# Altium schematic sheet other.SchDoc
size A4
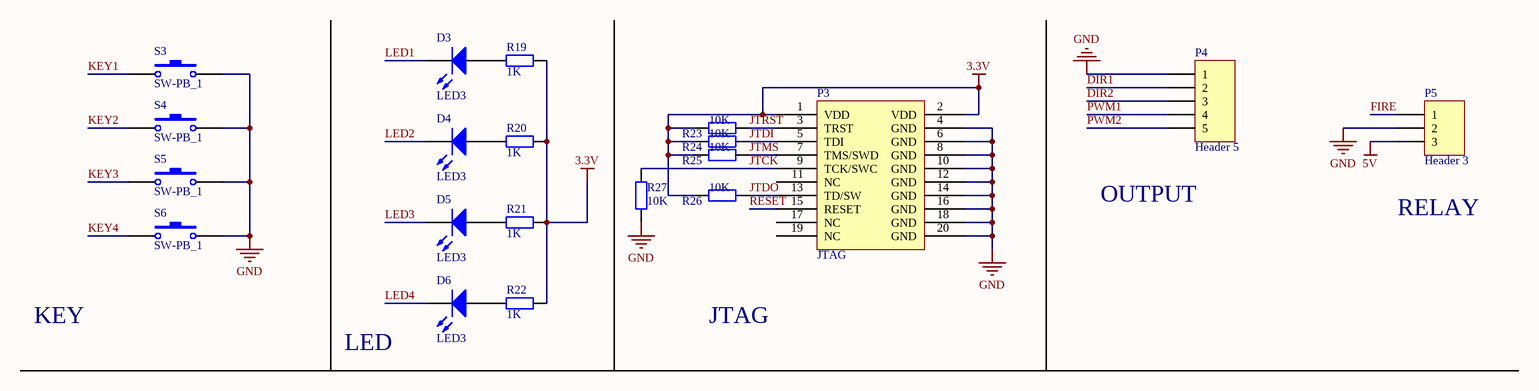
[diagram p0: other.SchDoc]

## Parts
D3  LED3  [0603-1]
D4  LED3  [0603-1]
D5  LED3  [0603-1]
D6  LED3  [0603-1]
P3  JTAG  [JTAG]
P4  Header 5  [HDR1X5]
P5  Header 3  [HDR1X3]
R19  value 1K  [R-0603]  (hidden comment: Res2)
R20  value 1K  [R-0603]  (hidden comment: Res2)
R21  value 1K  [R-0603]  (hidden comment: Res2)
R22  value 1K  [R-0603]  (hidden comment: Res2)
R23  value 10K  [R-0603]  (hidden comment: Res2)
R24  value 10K  [R-0603]  (hidden comment: Res2)
R25  value 10K  [R-0603]  (hidden comment: Res2)
R26  value 10K  [R-0603]  (hidden comment: Res2)
R27  value 10K  [R-0603]  (hidden comment: Res2)
S3  SW-PB_1  [SW-2-6*3]
S4  SW-PB_1  [SW-2-6*3]
S5  SW-PB_1  [SW-2-6*3]
S6  SW-PB_1  [SW-2-6*3]

## Nets
3.3V: P3.1(VDD) P3.2(VDD) R19.1 R20.1 R21.1 R22.1 R23.2 R24.2 R25.2 R26.2
5V: P5.3
GND: P3.4(GND) P3.6(GND) P3.8(GND) P3.10(GND) P3.12(GND) P3.14(GND) P3.16(GND) P3.18(GND) P3.20(GND) P4.1 P5.2 R27.2 S3.2 S4.2 S5.2 S6.2
DIR1: P4.2
DIR2: P4.3
FIRE: P5.1
JTCK: P3.9(TCK/SWC) R27.1
JTDI: P3.5(TDI) R24.1
JTDO: P3.13(TD/SW) R26.1
JTMS: P3.7(TMS/SWD) R25.1
JTRST: P3.3(TRST) R23.1
KEY1: S3.1
KEY2: S4.1
KEY3: S5.1
KEY4: S6.1
LED1: D3.2(K)
LED2: D4.2(K)
LED3: D5.2(K)
LED4: D6.2(K)
PWM1: P4.4
PWM2: P4.5
RESET: P3.15(RESET)
NetD3_1: D3.1(A) R19.2
NetD4_1: D4.1(A) R20.2
NetD5_1: D5.1(A) R21.2
NetD6_1: D6.1(A) R22.2

Not connected (* = marked no-connect by the designer): P3 11(NC) 17(NC) 19(NC)

## Notes on the sheet
- OUTPUT
- RELAY
- KEY
- LED
- JTAG

## Library data of the parts
D3-D6 = LED3: Typical BLUE SiC LED; Published: 8-Jun-2000; LatestRevisionDate: 17-Dec-2003; LatestRevisionNote: PCB Footprint replaced.; DatasheetVersion: 16-Apr-2002; PackageVersion: 16-Apr-2002; PackageReference: 3.5X2.8X1.9; Publisher: Altium Limited
P4 = Header 5: Header, 5-Pin; LatestRevisionDate: 17-Jul-2002; LatestRevisionNote: Re-released for DXP Platform.; Publisher: Altium Limited
P5 = Header 3: Header, 3-Pin; LatestRevisionDate: 17-Jul-2002; LatestRevisionNote: Re-released for DXP Platform.; Publisher: Altium Limited
R19-R27 = Res2: Resistor; Published: 8-Jun-2000; LatestRevisionDate: 17-Jul-2002; LatestRevisionNote: Re-released for DXP Platform.; PackageReference: AXIAL-0.4; Publisher: Altium Limited; PackageDescription: Axial Device, Thru-Hole; 2 Leads; 0.4 in Pin Spacing
S3-S6 = SW-PB_1: Switch; Published: 24-Mar-1999; LatestRevisionDate: 17-Jul-2002; LatestRevisionNote: Re-released for DXP Platform.; PackageReference: SPST-2; Publisher: Altium Limited